# EasyEDA Pro project GIM8108-8伺泰威无刷电机.epro, board PCB1
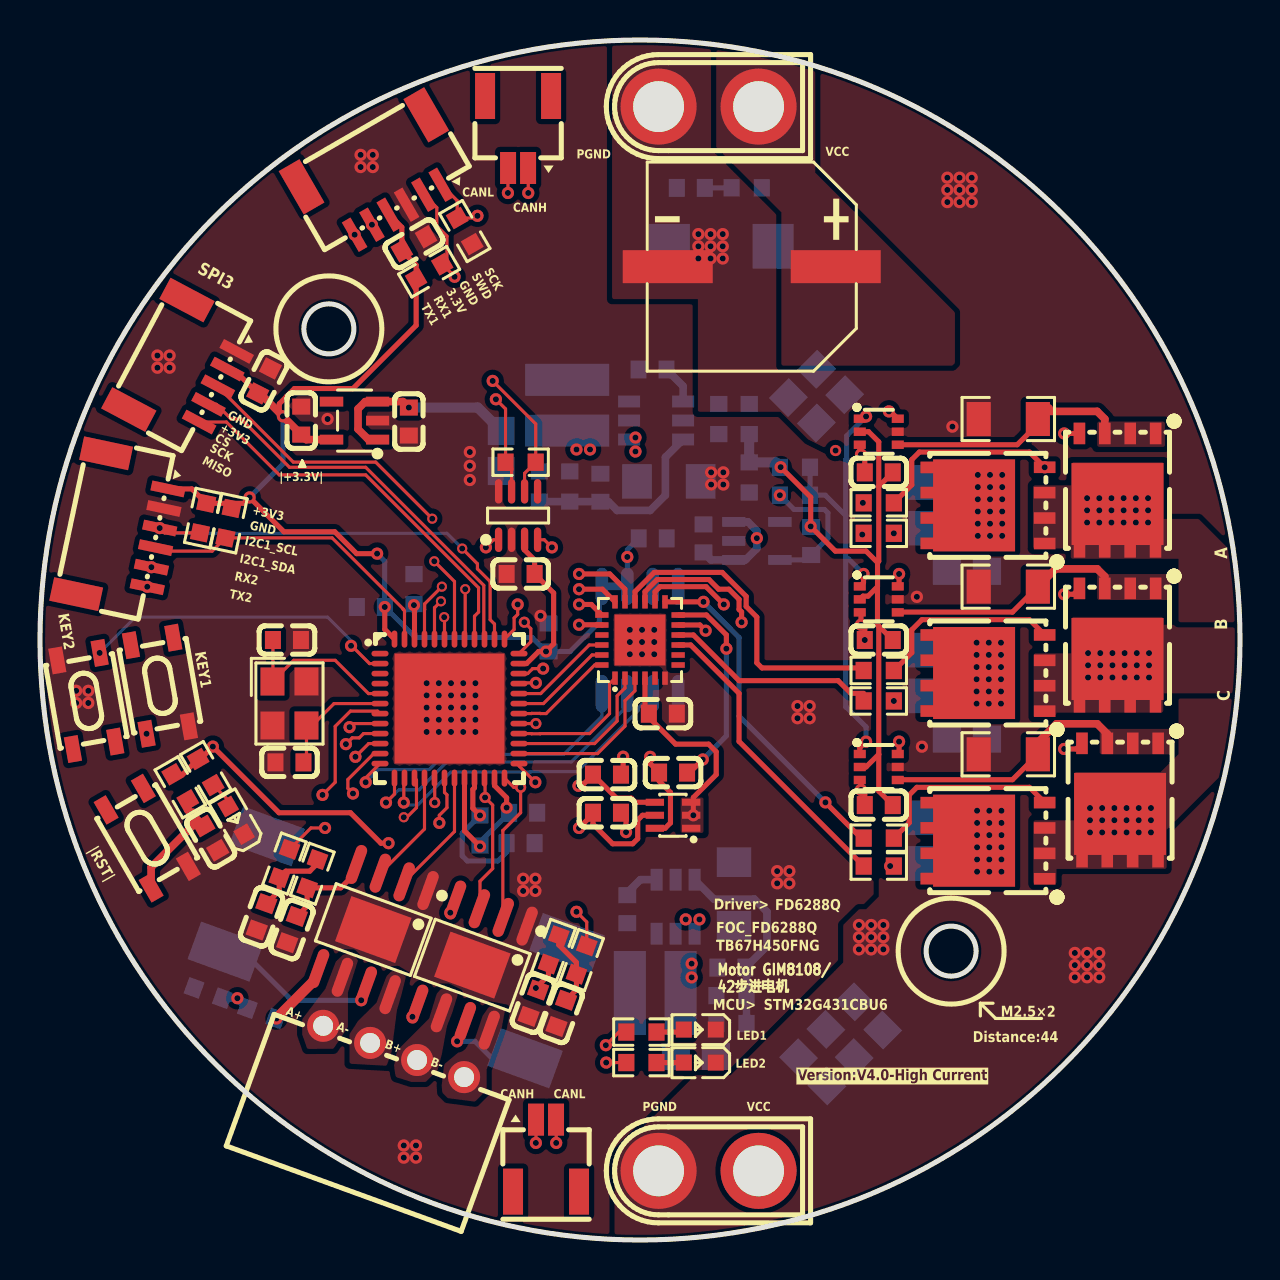
[diagram p1: board, top side]
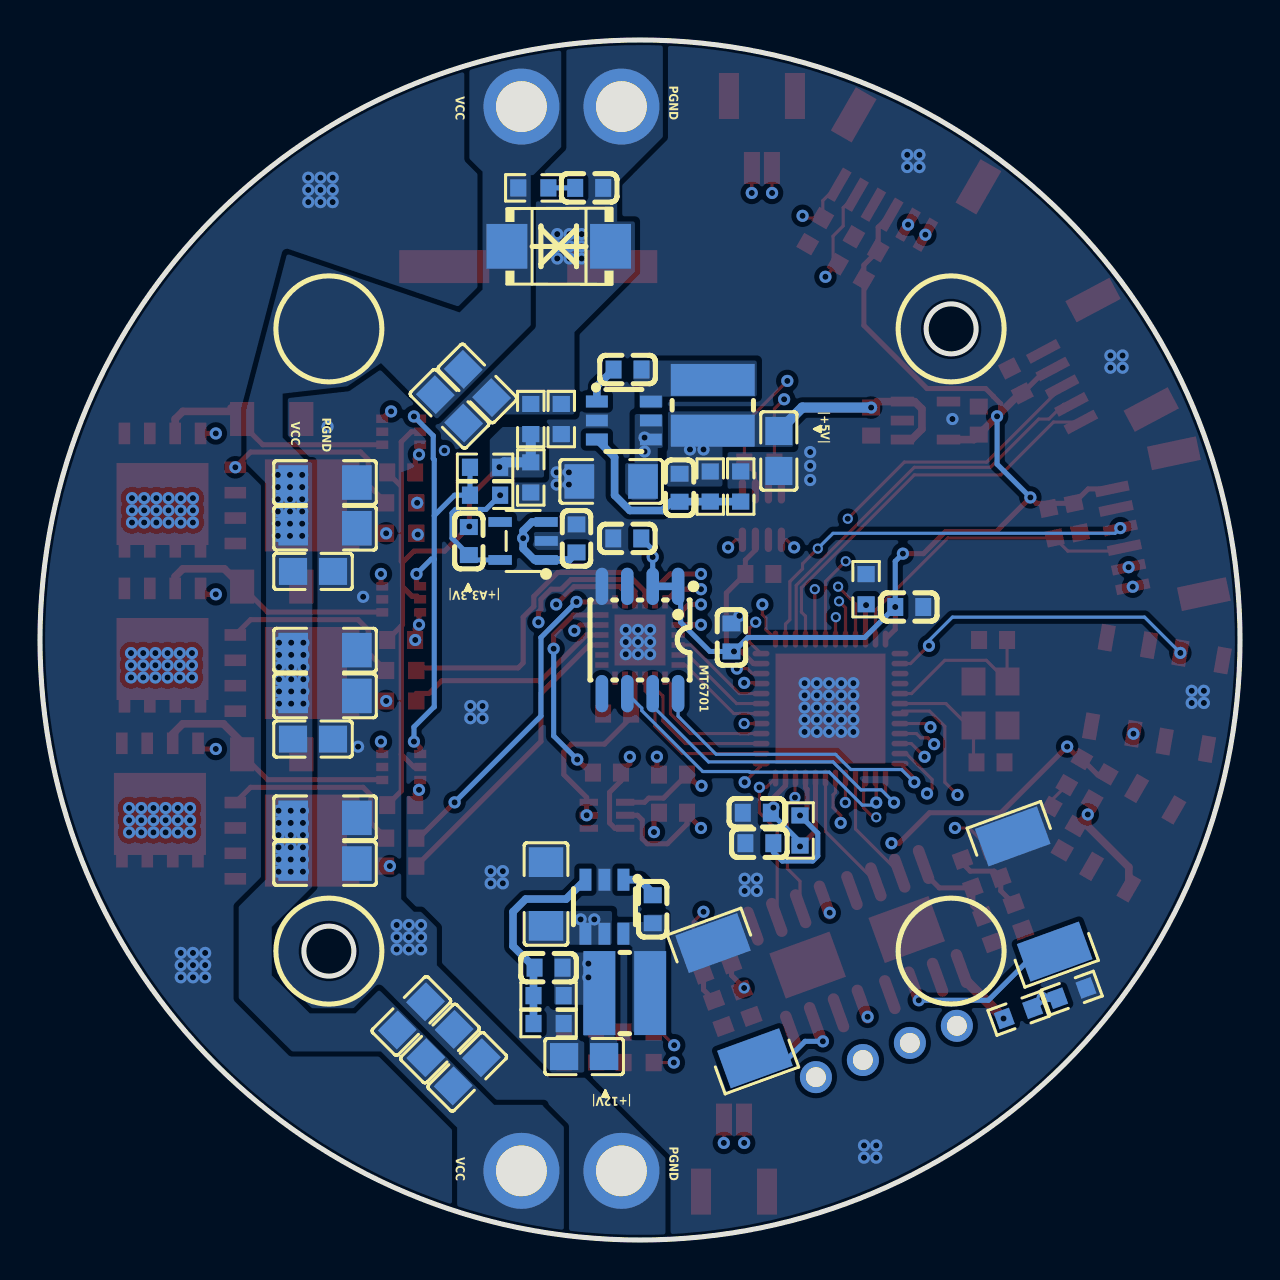
[diagram p2: board, bottom side, seen from below]

Outline 60 x 60 mm; copper layers: Top Layer, Inner1, Inner2, Bottom Layer. Coordinates in mm from the lower left corner of the outline.
Outline path: circle c14.44,45.56 r1.25 ; circle c30,30 r30 ; circle c45.56,14.44 r1.25
Stack: Top Layer 0.035mm 外层铜厚1oz / Dielectric1 0.2104mm 7628 RC49% 8.6mil / Inner1 0.0152mm 内层铜厚 / Dielectric2 1.065mm 1.1mm H/HOZ Copper / Inner2 0.0152mm 内层铜厚 / Dielectric3 0.2104mm 7628 RC49% 8.6mil / Bottom Layer 0.035mm 外层铜厚1oz

## Design rules (mm)
spacing copperThickness1oz (default): track to track 0.102, other pairs 0.152 to 0.3
spacing copperThickness2oz: track to track 0.203, other pairs 0.152 to 0.3
spacing Plane_innerPlane: track to track 0.102, other pairs 0.152 to 0.3
spacing Copper_copperRegion: track to track 0.102, other pairs 0.152 to 0.3
track width copperThickness1oz (default): min 0.127, default 0.254, max 2.54
track width copperThickness2oz: min 0.203, default 0.254, max 2.54
differential pair differentialPair (default): width min 0.127, default 0.254, max 2.54; gap min 0.152, default 0.152
net AGND uses copperRegion_copperThickness1oz
net B- uses copperRegion_copperThickness1oz
net B+ uses copperRegion_copperThickness1oz
net A- uses copperRegion_copperThickness1oz
net A+ uses copperRegion_copperThickness1oz
pour e1013 uses Copper_copperRegion, copperRegion_Copper_copperRegion
pour e1015 uses Copper_copperRegion, copperRegion_Copper_copperRegion
pour e1017 uses Copper_copperRegion, copperRegion_Copper_copperRegion
pour e1019 uses Copper_copperRegion, copperRegion_Copper_copperRegion
pour e1021 uses Copper_copperRegion, copperRegion_Copper_copperRegion
pour e1023 uses Copper_copperRegion, copperRegion_Copper_copperRegion
pour e1025 uses Copper_copperRegion, copperRegion_Copper_copperRegion
pour e1027 uses Copper_copperRegion, copperRegion_Copper_copperRegion
pour e1029 uses Copper_copperRegion, copperRegion_Copper_copperRegion
pour e1031 uses Copper_copperRegion, copperRegion_Copper_copperRegion
pour e1032 uses Copper_copperRegion, copperRegion_Copper_copperRegion
pour e1034 uses Copper_copperRegion, copperRegion_Copper_copperRegion
pour e1036 uses Copper_copperRegion, copperRegion_Copper_copperRegion
pour e1037 uses Copper_copperRegion, copperRegion_Copper_copperRegion
pour e1038 uses Copper_copperRegion, copperRegion_Copper_copperRegion
pour e1042 uses Copper_copperRegion, copperRegion_Copper_copperRegion
pour e1044 uses Copper_copperRegion, copperRegion_Copper_copperRegion
pour e1046 uses Copper_copperRegion, copperRegion_Copper_copperRegion
pour e1048 uses Copper_copperRegion, copperRegion_Copper_copperRegion
pour e1050 uses Copper_copperRegion, copperRegion_Copper_copperRegion
pour e1055 uses Copper_copperRegion, copperRegion_Copper_copperRegion
pour e1060 uses Copper_copperRegion, copperRegion_Copper_copperRegion
pour e1062 uses Copper_copperRegion, copperRegion_Copper_copperRegion
pour e1064 uses Copper_copperRegion, copperRegion_Copper_copperRegion
pour e1066 uses Copper_copperRegion, copperRegion_Copper_copperRegion
pour e1068 uses Copper_copperRegion, copperRegion_Copper_copperRegion
pour e1072 uses Copper_copperRegion, copperRegion_Copper_copperRegion
pour e1076 uses Copper_copperRegion, copperRegion_Copper_copperRegion
pour e1655 uses Copper_copperRegion, copperRegion_Copper_copperRegion
pour e1657 uses Copper_copperRegion, copperRegion_Copper_copperRegion
pour e1661 uses Copper_copperRegion, copperRegion_Copper_copperRegion
pour e1666 uses Copper_copperRegion, copperRegion_Copper_copperRegion
pour e1768 uses Copper_copperRegion, copperRegion_Copper_copperRegion

## Placement (name value [footprint] x y rotation side)
C12  47uF/50V  [C1206]  31.44 37.93 180 bottom
C13  100pF  [C0603]  28.02 37.61 90 bottom
C14  22uF/25V  [C0805]  23.06 39.45 90 bottom
C29  10uF  [C0603]  24.03 33.3 0 top
C35  100nF  [C0603]  24.16 21.36 180 bottom
C36  100nF  [C0603]  25.43 30.13 270 bottom
C37  100nF  [C0603]  16.54 31.65 0 bottom
C45  100nF  [C0603]  8.54 20.09 300 top
C54  10nF/50V  [C0603]  32.54 52.61 180 bottom
C55  22uF/50V  [C1206]  45.75 27.21 0 bottom
C56  100nF  [C0603]  11.08 16.16 250 top
C57  100nF  [C0603]  12.6 15.52 250 top
C58  100nF  [C0603]  26.06 11.33 250 top
C59  100nF  [C0603]  24.67 11.84 250 top
C61  22uF/50V  [C1206]  45.75 18.82 0 bottom
C65  100nF  [C0603]  13.06 40.97 90 top
C68  100nF  [C0603]  30.63 35.08 0 bottom
C71  20pF  [C0603]  12.35 30 180 top
C72  20pF  [C0603]  12.47 23.88 0 top
C100  100nF  [C0603]  30.62 43.52 180 bottom
C101  100nF  [C0603]  29.37 16.54 270 bottom
C102  47uF/50V  [C1206]  34.7 17.3 270 bottom
C103  100pF  [C0603]  34.57 13.62 180 bottom
C104  22uF/25V  [C0805]  32.79 9.17 180 bottom
C105  100nF  [C0603]  18.44 40.92 270 top
C106  100nF  [C0603]  38.56 34.95 90 bottom
C107  100nF  [C0603]  33.18 35.08 90 bottom
C108  22uF/50V  [C1206]  45.75 29.49 0 bottom
C109  22uF/50V  [C1206]  45.75 37.87 0 bottom
C112  100nF  [C0603]  18.7 49.81 210 top
C120  100nF  [C0603]  41.94 38.38 180 top
C121  100nF  [C0603]  41.94 30 180 top
C122  100nF  [C0603]  41.94 21.75 180 top
C123  1uF/25V  [C0603]  28.35 23.27 180 top
C124  1uF/25V  [C0603]  28.35 21.36 180 top
C125  1uF/25V  [C0603]  31.65 23.37 180 top
C126  10uF/25V  [C0603]  31.14 26.32 180 top
C127  22uF/50V  [C1206]  45.75 35.59 0 bottom
C130  330uF  [CAP-SMD_BD10.0-L10.3-W10.3-FD-LS11.0]  35.59 48.67 180 top
C131  10uF/50V  [C0805]  38.13 42.83 45 bottom
C132  10uF/50V  [C0805]  46.35 33.43 0 bottom
C133  10uF/50V  [C0805]  46.35 25.05 0 bottom
C134  10uF/50V  [C0805]  41.43 11.2 315 bottom
C136  10uF/50V  [C0805]  40 9.82 315 bottom
C138  10uF/50V  [C0805]  39.53 41.56 45 bottom
C139  10uF/50V  [C0805]  38.64 8.41 315 bottom
C141  100nF  [C0603]  11.2 42.95 63 top
C142  22uF/50V  [C1206]  45.75 21.11 0 bottom
C143  100nF  [C0603]  24.03 19.84 180 bottom
CN4  WAFER-XH2.54-4PWZ  [CONN-TH_4P-P2.50_WAFER-XH2.54-4PWZ]  17.68 9.43 340 top
CN6  XT30U-M  [CONN-TH_XT30U-M]  33.43 56.67 180 top
CN7  XT30U-M  [CONN-TH_XT30U-M]  33.43 3.46 180 top
D3  BAS16TW  [SOT-363_L2.1-W1.3-P0.65-LS2.3-BL]  31.65 21.24 90 top
D4  SMBJ36CA  [SMB_L4.4-W3.6-LS5.3-BI]  34.06 49.69 180 bottom
L1  3.3uH  [IND-SMD_L3.8-W3.8_GCRH3D16-XX]  30.76 12.35 0 bottom
L2  3.3uH  [IND-SMD_L3.8-W3.8_GCRH3D16-XX]  26.36 41.74 270 bottom
LED6  KT-0603R  [LED0603-RD]  9.81 20.98 120 top
LED7  KT-0603R  [LED0603-RD]  32.99 10.52 180 top
LED8  KT-0603R  [LED0603-RD]  32.99 8.87 180 top
Q7  NCEP4090GU  [PDFN-8_L5.8-W5.1-P1.27-LS6.1-BL]  47.4 36.73 90 top
Q8  NCEP4090GU  [PDFN-8_L5.8-W5.1-P1.27-LS6.1-BL]  53.88 37.49 180 top
Q9  NCEP4090GU  [PDFN-8_L5.8-W5.1-P1.27-LS6.1-BL]  47.4 28.35 90 top
Q10  NCEP4090GU  [PDFN-8_L5.8-W5.1-P1.27-LS6.1-BL]  53.88 29.75 180 top
Q11  NCEP4090GU  [PDFN-8_L5.8-W5.1-P1.27-LS6.1-BL]  47.4 19.97 90 top
Q12  NCEP4090GU  [PDFN-8_L5.8-W5.1-P1.27-LS6.1-BL]  54 22 180 top
R24  120  [R0603]  24.03 38.89 0 top
R28  0  [R0603]  22 20.47 270 bottom
R29  10K  [R0603]  18.7 32.54 90 bottom
R30  1K  [R0603]  7.01 22.63 300 top
R33  3.3  [R0603]  35.33 52.61 0 bottom
R47  1K  [R0603]  12.22 18.82 250 top
R48  1K  [R0603]  13.62 18.32 250 top
R49  1K  [R0603]  27.08 14 250 top
R50  1K  [R0603]  25.68 14.51 250 top
R66  100mΩ  [RES-SMD_L6.4-W3.2-R2512]  10.31 17.3 70 bottom
R67  100mΩ  [RES-SMD_L6.4-W3.2-R2512]  25.3 11.97 70 bottom
R72  110K  [R0603]  26.49 37.67 270 bottom
R73  15K  [R0603]  24.96 37.67 270 bottom
R74  390K  [R0603]  34.57 12.22 0 bottom
R75  20K  [R0603]  34.57 10.82 0 bottom
R79  1K  [R0603]  8.28 23.4 300 top
R80  0  [R0603]  35.46 38.13 90 bottom
R81  0  [R0603]  33.94 41.05 90 bottom
R82  0  [R0603]  35.46 41.05 90 bottom
R85  10K  [R0603]  19.46 48.42 210 top
R86  10K  [R0603]  21.24 50.45 120 top
R87  10  [R0603]  41.94 36.86 0 top
R88  10  [R0603]  41.94 28.48 0 top
R89  10  [R0603]  41.94 20.09 0 top
R90  10  [R0603]  41.94 35.33 0 top
R91  10  [R0603]  41.94 18.7 0 top
R92  10  [R0603]  41.94 26.95 0 top
R93  39K  [R0603]  11.08 11.33 340 bottom
R95  3K  [R0603]  8.41 12.35 340 bottom
R96  2mΩ  [R1206]  48.41 41.05 0 top
R97  2mΩ  [R1206]  48.41 32.67 0 top
R98  2mΩ  [R1206]  48.41 24.28 0 top
R101  10K  [R0603]  37.75 37.24 0 bottom
R102  10K  [R0603]  37.75 38.64 180 bottom
R103  1K  [R0603]  30.07 10.4 0 top
R104  1K  [R0603]  30.07 8.87 0 top
R105  4.7K  [R0603]  8.16 36.1 258 top
R106  4.7K  [R0603]  9.43 35.84 258 top
SW1  K2-1808SN-A3SW-01  [SW-SMD_4P-L4.2-W3.3-P2.15-LS5.1]  5.36 20.09 120 top
SW3  K2-1808SN-A3SW-01  [SW-SMD_4P-L4.2-W3.3-P2.15-LS5.1]  6 27.71 100 top
SW4  K2-1808SN-A3SW-01  [SW-SMD_4P-L4.2-W3.3-P2.15-LS5.1]  2.31 26.95 280 top
U1  STM32G431CBU6  [VQFN-48_L7.0-W7.0-P0.50-BL-EP5.5]  20.47 26.57 270 top
U2  INA199A1DCKR  [SC-70-6_L2.2-W1.3-P0.65-LS2.1-BR]  41.94 40.41 180 top
U4  INA199A1DCKR  [SC-70-6_L2.2-W1.3-P0.65-LS2.1-BR]  41.94 23.65 180 top
U5  MAX3051EKA+T  [SOT-23-8_L3.0-W1.7-P0.65-LS2.8-TL]  23.9 36.22 90 top
U9  TB67H450FNG,EL  [HSOP-8_L5.0-W4.0-P1.27-LS6.2-BL-EP]  16.66 15.52 160 top
U10  FD6288Q  [QFN-24_L4.0-W4.0-P0.50-BL-EP2.6]  30 30 0 top
U11  MT6701CT-STD  [SOP-8_L4.9-W3.9-P1.27-LS6.0-BL]  30 30 0 bottom
U13  SPX3819M5-L-3-3/TR  [SOT-23-5_L3.0-W1.7-P0.95-LS2.8-BL]  15.73 40.97 90 top
U20  INA199A1DCKR  [SC-70-6_L2.2-W1.3-P0.65-LS2.1-BR]  41.94 32.03 180 top
U23  ME3121AM6G  [SOT-23-6_L2.9-W1.6-P0.95-LS2.8-BR]  30.81 40.97 0 bottom
U24  ME3121AM6G  [SOT-23-6_L2.9-W1.6-P0.95-LS2.8-BR]  31.78 16.67 90 bottom
U25  SPX3819M5-L-3-3/TR  [SOT-23-5_L3.0-W1.7-P0.95-LS2.8-BL]  35.84 34.95 90 bottom
U27  ZX-SH1.0-2PWT  [CONN-SMD_2P-P1.00_HX-1.0-2P-WT]  23.9 55.4 180 top
U28  ZX-SH1.0-2PWT  [CONN-SMD_2P-P1.00_HX-1.0-2P-WT]  25.3 4.22 0 top
U29  ZX-SH1.0-6PWT  [CONN-SMD_6P-P1.00_MEGASTAR_ZX-SH1.0-6PWT]  17.05 52.99 210 top
U30  ZX-SH1.0-5PWT  [CONN-SMD_5P-P1.00_MEGASTAR_ZX-SH1.0-5PWT]  7.39 43.46 242 top
U31  TB67H450FNG,EL  [HSOP-8_L5.0-W4.0-P1.27-LS6.2-BL-EP]  21.62 13.74 160 top
U32  ZX-SH1.0-6PWT  [CONN-SMD_6P-P1.00_MEGASTAR_ZX-SH1.0-6PWT]  4.22 35.46 258 top
X3  8MHz  [CRYSTAL-SMD_4P-L3.2-W2.5-BL]  12.47 26.83 270 top

## Footprints (pads in the part's own frame, mm; a bottom-side part is the same pattern mirrored in y, then rotated)
C0603
  rect 0.8x0.9 smd: 1(-0.7,0) 2(0.7,0)
C0805
  rect 1.41x1.35 smd: 1(-1,0) 2(1,0)
C1206
  rect 1.485x1.728 smd: 1(-1.593,0) 2(1.593,0)
CAP-SMD_BD10.0-L10.3-W10.3-FD-LS11.0
  rect 4.5x1.65 smd: 1(-4.2,0) 2(4.2,0)
CONN-SMD_2P-P1.00_HX-1.0-2P-WT
  rect 0.8x1.6 smd: 1(-0.5,1.8) 2(0.5,1.8)
  rect 1x2.3 smd: 3(1.65,-1.8) 4(-1.65,-1.8)
CONN-SMD_5P-P1.00_MEGASTAR_ZX-SH1.0-5PWT
  rect 0.5x1.7 smd: 1(-2,1.7) 2(-1,1.7) 3(0,1.7) 4(1,1.7) 5(2,1.7)
  rect 1.2x2.5 smd: 6(3.1,-1.7) 7(-3.1,-1.7)
CONN-SMD_6P-P1.00_MEGASTAR_ZX-SH1.0-6PWT
  rect 0.5x1.7 smd: 1(-2.5,1.7) 2(-1.5,1.7) 3(-0.5,1.7) 4(0.5,1.7) 5(1.5,1.7) 6(2.5,1.7)
  rect 1.2x2.5 smd: 7(3.6,-1.7) 8(-3.6,-1.7)
CONN-TH_4P-P2.50_WAFER-XH2.54-4PWZ
  round 1.6 hole 1: 1(-3.75,0) 2(-1.25,0) 3(1.25,0) 4(3.75,0)
CONN-TH_XT30U-M
  round 3.8 hole 2.54: 1(-2.5,0) 2(2.5,0)
CRYSTAL-SMD_4P-L3.2-W2.5-BL
  rect 1.4x1.2 smd: 1(-1.1,-0.85) 2(1.1,-0.85) 3(1.1,0.85) 4(-1.1,0.85)
HSOP-8_L5.0-W4.0-P1.27-LS6.2-BL-EP
  oval 0.574x2.038 smd: 1(-1.905,-2.769) 2(-0.635,-2.769) 3(0.635,-2.769) 4(1.905,-2.769) 5(1.905,2.769) 6(0.635,2.769) 7(-0.635,2.769) 8(-1.905,2.769)
  rect 3.2x2.4 smd: 9(0,0)
IND-SMD_L3.8-W3.8_GCRH3D16-XX
  rect 1.6x4.2 smd: 1(-1.27,0) 2(1.27,0)
LED0603-RD
  rect 0.8x0.8 smd: 1(-0.799,0) 2(0.799,0)
PDFN-8_L5.8-W5.1-P1.27-LS6.1-BL
  rect 0.58x1.079 smd: 1(-1.905,-2.834) 2(-0.635,-2.834) 3(0.635,-2.834) 4(1.905,-2.834)
  rect 0.58x1.08 smd: 5(1.9,2.834) 6(0.64,2.834) 7(-0.63,2.834) 8(-1.9,2.834)
  rect 4.6x4.1 smd: 9(0,0.695)
QFN-24_L4.0-W4.0-P0.50-BL-EP2.6
  rect 0.28x0.665 smd: 1(-1.25,-1.907) 2(-0.75,-1.907) 3(-0.25,-1.907) 4(0.25,-1.907) 5(0.75,-1.907) 6(1.25,-1.907) 13(1.25,1.907) 14(0.75,1.907) 15(0.25,1.907) 16(-0.25,1.907) 17(-0.75,1.907) 18(-1.25,1.907)
  rect 0.665x0.28 smd: 7(1.907,-1.25) 8(1.907,-0.75) 9(1.907,-0.25) 10(1.907,0.25) 11(1.907,0.75) 12(1.907,1.25) 19(-1.907,1.25) 20(-1.907,0.75) 21(-1.907,0.25) 22(-1.907,-0.25) 23(-1.907,-0.75) 24(-1.907,-1.25)
  rect 2.55x2.55 smd: 25(0,0)
R0603
  rect 0.806x0.864 smd: 1(-0.753,0) 2(0.753,0)
R1206
  rect 1.208x1.701 smd: 1(-1.479,0) 2(1.479,0)
RES-SMD_L6.4-W3.2-R2512
  rect 2x3.3 smd: 1(-3.067,0) 2(3.067,0)
SC-70-6_L2.2-W1.3-P0.65-LS2.1-BR
  rect 0.6x0.42 smd: 1(0.95,-0.65) 2(0.95,0) 3(0.95,0.65) 4(-0.95,0.65) 5(-0.95,0) 6(-0.95,-0.65)
SMB_L4.4-W3.6-LS5.3-BI
  rect 2.047x2.241 smd: 1(-2.591,0) 2(2.591,0)
SOP-8_L4.9-W3.9-P1.27-LS6.0-BL
  oval 0.63x1.865 smd: 1(-1.905,-2.683) 2(-0.635,-2.683) 3(0.635,-2.683) 4(1.905,-2.683) 5(1.905,2.683) 6(0.635,2.683) 7(-0.635,2.683) 8(-1.905,2.683)
SOT-23-5_L3.0-W1.7-P0.95-LS2.8-BL
  rect 0.49x1.157 smd: 1(-0.95,-1.153) 2(0,-1.153) 3(0.95,-1.153)
  rect 0.49x1.175 smd: 4(0.95,1.153) 5(-0.95,1.153)
SOT-23-6_L2.9-W1.6-P0.95-LS2.8-BR
  rect 1.1x0.6 smd: 1(1.35,-0.95) 2(1.35,0) 3(1.35,0.95) 4(-1.35,0.95) 5(-1.35,0) 6(-1.35,-0.95)
SOT-23-8_L3.0-W1.7-P0.65-LS2.8-TL
  oval 1.222x0.364 smd: 1(-1.211,0.975) 2(-1.211,0.325) 3(-1.211,-0.325) 4(-1.211,-0.975) 5(1.211,-0.975) 6(1.211,-0.325) 7(1.211,0.325) 8(1.211,0.975)
SOT-363_L2.1-W1.3-P0.65-LS2.3-BL
  rect 0.35x0.916 smd: 1(-0.65,-0.908) 2(0,-0.908) 3(0.65,-0.908) 4(0.65,0.908) 5(0,0.908) 6(-0.65,0.908)
SW-SMD_4P-L4.2-W3.3-P2.15-LS5.1
  rect 1.3x0.7 smd: 1(-2.25,1.075) 2(2.25,1.075) 3(-2.25,-1.075) 4(2.25,-1.075)
VQFN-48_L7.0-W7.0-P0.50-BL-EP5.5
  oval 0.28x0.85 smd: 1(-2.75,-3.474) 2(-2.25,-3.474) 3(-1.75,-3.474) 4(-1.25,-3.474) 5(-0.75,-3.474) 6(-0.25,-3.474) 7(0.25,-3.474) 8(0.75,-3.474) 9(1.25,-3.474) 10(1.75,-3.474) 11(2.25,-3.474) 12(2.75,-3.474) 25(2.75,3.474) 26(2.25,3.474) 27(1.75,3.474) 28(1.25,3.474) 29(0.75,3.474) 30(0.25,3.474) 31(-0.25,3.474) 32(-0.75,3.474) 33(-1.25,3.474) 34(-1.75,3.474) 35(-2.25,3.474) 36(-2.75,3.474)
  oval 0.85x0.28 smd: 13(3.474,-2.75) 14(3.474,-2.25) 15(3.474,-1.75) 16(3.474,-1.25) 17(3.474,-0.75) 18(3.474,-0.25) 19(3.474,0.25) 20(3.474,0.75) 21(3.474,1.25) 22(3.474,1.75) 23(3.474,2.25) 24(3.474,2.75) 37(-3.474,2.75) 38(-3.474,2.25) 39(-3.474,1.75) 40(-3.474,1.25) 41(-3.474,0.75) 42(-3.474,0.25) 43(-3.474,-0.25) 44(-3.474,-0.75) 45(-3.474,-1.25) 46(-3.474,-1.75) 47(-3.474,-2.25) 48(-3.474,-2.75)
  rect 5.5x5.5 smd: 49(0,0)

## Nets
As in the schematic.

Pads without a net: SW1 2 4; SW3 2 4; SW4 2 4; U1 1 3 4; U5 5; U10 5 7 8 21; U11 3 5; U13 4; U25 4; U27 3 4; U28 3 4; U29 7 8; U30 6 7; U32 7 8

## Via types
v1: diameter 0.61, hole 0.305, Top Layer to Bottom Layer, 321 vias
v2: diameter 0.559, hole 0.305, Top Layer to Bottom Layer, 7 vias
v3: diameter 0.508, hole 0.305, Top Layer to Bottom Layer, 8 vias

## Routing (per net, layer and track width the routed paths; a pad name or vN(x,y) marks a point on that pad's centre or on a via; arc(x,y) is an arc through that point)
+3.3V: length 143.8
  Top Layer w0.254: U5.3 24.23,34.5 24.73,34 C29.2 25.68,32.35 25.68,29.81 v1(25.3,29.43) 24.93,29.43 24.33,28.82 U1.35 ; U1.48 17.24,30.53 v1(17.24,31.65) ; U20.3 41.05,31.32 v1(41.05,30.76) 41.24,30.57 v1(41.24,30) ; 11.97,41.36 11.97,41.81 12.33,42.18 12.33,42.19 12.72,42.57 15.65,42.57 18.81,45.73 R85.2 18.81,48.75 18.09,49.46 18.09,50.64 17.46,51.26 ; U1.23 22.72,22.72 23.33,22.11 v1(23.33,21.62) ; U30.2 9.54,43.55 9.62,43.47 9.75,43.47 C141.1 ; U4.3 41.05,22.94 v1(41.05,22.51) 41.24,22.32 C122.2 ; v1(17.43,19.84) 17.05,19.84 15.52,21.36 11.95,21.36 v1(8.64,24.67) 8.02,24.05 R79.1 7.14,23.29 R30.1 ; v1(22,19.68) 21.22,20.45 U1.20 ; C120.2 41.24,39.08 v1(41.05,39.27) 40.99,39.33 U2.3 ; v1(16.85,34.32) 15.83,34.32 14.74,35.41 12.19,35.41 v1(10.48,37.13) 10.19,36.83 8.31,36.83 7.59,37.55 U32.1
  Top Layer w0.381: C141.1 11,42.33 11.97,41.36 v1(12.15,41.18) C65.1 13.31,40.02 U13.5
  Inner1 w0.254: v1(8.64,24.67) 8.64,29.72 10.57,31.65 v1(17.24,31.65)
  Inner2 w0.254: v1(41.05,30.76) 40.63,31.18 ; 40.63,31.18 40.41,31.4 ; 40.63,31.18 40.29,30.84 40.29,23.27 v1(41.05,22.51) ; 40.41,31.4 36.99,31.4 34.23,34.15 v1(29.37,34.15) ; 40.41,31.4 40.41,38.64 v1(41.05,39.27) ; v1(22,19.68) 21.84,19.84 v1(17.43,19.84)
  Bottom Layer w0.254: C35.2 22,19.91 R28.2 ; v1(16.85,34.32) 17.24,33.94 v1(17.24,31.65) 18.76,30.13 24.6,30.13 v1(25.3,29.43) ; v1(12.15,41.18) 12.15,38.79 v1(10.48,37.13) ; C68.1 29.37,34.51 v1(29.37,34.15) U11.2 ; 25.43,29.43 26.51,29.43 27.97,30.89 27.97,32.56 U11.1
  Bottom Layer w0.381: U11.2 U11.1
+5V: length 25.6
  Top Layer w0.381: U13.1 16.42,40.02 15.9,40.54 15.9,41.56 16.27,41.92 U13.3 18.15,41.92 v1(18.44,41.62)
  Inner1 w0.508: v1(27.5,39.53) 31.95,35.08 35.83,35.08 v1(35.84,35.09)
  Bottom Layer w0.381: U25.3 35.4,35.9 35.84,35.46 v1(35.84,35.09) 35.84,34.57 35.27,34 U25.1 33.55,34 C107.1
  Bottom Layer w0.508: v1(18.44,41.62) 21.89,41.62 C14.2
  vias: v1(26.82,39.53)
+12V: length 18.6
  Top Layer w0.254: U10.4 30.25,26.51 C126.2 30.44,26.13 31.78,24.79 33.43,24.79 33.81,24.41 33.81,23.27 32.67,22.13 v1(32.67,21.24)
  Inner1 w0.254: v1(32.58,13.82) 32.09,13.82 31.27,14.63 31.27,16.28 32.67,17.68 v1(32.67,21.24)
  vias: v1(32.58,13.13)
+AVDD_3.3V: length 6.9
  Bottom Layer w0.254: U25.5 38.31,34 C106.1 39.4,35.09 39.4,36.35 39.22,36.53 37.7,36.53 v1(36.99,37.24)
AGND: length 34.8
  Top Layer w0.254: 41.94,37.68 C120.1 ; 41.94,37.68 41.94,39.91 41.43,40.41 U2.2 ; 41.94,37.68 41.94,33.94 41.87,33.87 41.3,34.44 39.77,34.44 v1(38.53,35.68) 38.53,37.14 v1(37.03,38.64) ; 41.94,30.7 41.94,24.28 ; 41.94,30.7 C121.1 ; 41.94,30.7 41.87,30.76 41.87,32.66 41.4,32.19 41.15,32.19 U20.2 ; 41.94,24.28 41.3,23.65 U4.2 ; 41.94,24.28 41.94,22.44 C122.1 ; 41.88,33.87 41.88,32.67
  Bottom Layer w0.508: R82.1 R80.2 36.79,38.88 v1(37.03,38.64)
GND:
  vias: v1(1.81,27.46) v1(1.81,26.85) v1(2.42,27.46) v1(2.42,26.85) v1(5.87,44.22) v1(5.87,43.61) v1(6.48,44.22) v1(6.48,43.61) v1(14.38,41.05) v1(16.03,54.26) v1(16.03,53.65) v1(16.64,54.26) v1(16.64,53.65) v1(18.19,4.73) v1(18.19,4.12) v1(18.8,4.73) v1(18.8,4.12) v1(19.33,27.84) v1(19.33,27.23) v1(19.33,26.62) v1(19.33,26.01) v1(19.33,25.4) v1(19.94,27.84) v1(19.94,27.23) v1(19.94,26.62) v1(19.94,26.01) v1(19.94,25.4) v1(20.55,27.84) v1(20.55,27.23) v1(20.55,26.62) v1(20.55,26.01) v1(20.55,25.4) v1(21.16,27.84) v1(21.16,27.23) v1(21.16,26.62) v1(21.16,26.01) v1(21.16,25.4) v1(21.49,39.4) v1(21.49,38.71) v1(21.49,38) v1(21.77,27.84) v1(21.77,27.23) v1(21.77,26.62) v1(21.77,26.01) v1(21.77,25.4) v1(24.16,18.06) v1(24.16,17.45) v1(24.77,18.06) v1(24.77,17.45) v1(25.03,31.21) v1(29.49,30.51) v1(29.49,29.9) v1(29.49,29.29) v1(30.1,30.51) v1(30.1,29.9) v1(30.1,29.29) v1(30.71,30.51) v1(30.71,29.9) v1(30.71,29.29) v1(33.56,38.38) v1(33.56,37.77) v1(34.17,38.38) v1(34.17,37.77) v1(36.86,18.44) v1(36.86,17.83) v1(37.47,18.44) v1(37.47,17.83) v1(37.87,26.7) v1(37.87,26.09) v1(38.48,26.7) v1(38.48,26.09)
PGND:
  vias: v1(32.92,50.29) v1(32.92,49.69) v1(32.92,49.08) v1(33.53,50.29) v1(33.53,49.69) v1(33.53,49.08) v1(34.14,50.29) v1(34.14,49.69) v1(34.14,49.08) v1(40.95,15.75) v1(40.95,15.14) v1(40.95,14.53) v1(41.56,15.75) v1(41.56,15.14) v1(41.56,14.53) v1(42.17,15.75) v1(42.17,15.14) v1(42.17,14.53) v1(43.84,32.16) v1(44.1,24.67) v1(45.37,53.11) v1(45.37,52.5) v1(45.37,51.89) v1(45.62,40.67) v1(45.98,53.11) v1(45.98,52.5) v1(45.98,51.89) v1(46.59,53.11) v1(46.59,52.5) v1(46.59,51.89) v1(51.74,14.35) v1(51.74,13.74) v1(51.74,13.13) v1(52.35,14.35) v1(52.35,13.74) v1(52.35,13.13) v1(52.96,14.35) v1(52.96,13.74) v1(52.96,13.13)
VCC: length 39.3
  Top Layer w0.508: v1(11.82,11.07) 11.82,11.09 13.67,12.94
  Inner1 w0.508: CN7.1 31.74,7.65 24.03,7.65 22.76,6.38 15.4,6.38 11.82,9.95 v1(11.82,11.07) 12.97,12.22 14.63,12.22 15.65,11.2 18.58,11.2 v1(18.62,11.16)
  vias: v1(29.77,40.12) v1(29.77,39.42) v1(32.29,16.03) v1(32.97,16.03) v1(46.83,29.87) v1(46.83,29.26) v1(46.83,28.65) v1(46.83,28.04) v1(46.83,27.43) v1(46.83,26.82) v1(46.89,38.25) v1(46.89,37.65) v1(46.89,37.04) v1(46.89,36.43) v1(46.89,35.82) v1(46.89,35.21) v1(46.85,21.46) v1(46.85,20.85) v1(46.85,20.24) v1(46.85,19.64) v1(46.85,19.03) v1(46.85,18.42) v1(47.44,29.87) v1(47.44,29.26) v1(47.44,28.65) v1(47.44,28.04) v1(47.44,27.43) v1(47.44,26.82) v1(47.5,38.25) v1(47.5,37.65) v1(47.5,37.04) v1(47.5,36.43) v1(47.5,35.82) v1(47.5,35.21) v1(47.46,21.46) v1(47.46,20.85) v1(47.46,20.24) v1(47.46,19.64) v1(47.46,19.03) v1(47.46,18.42) v1(48.05,29.87) v1(48.05,29.26) v1(48.05,28.65) v1(48.05,28.04) v1(48.05,27.43) v1(48.05,26.82) v1(48.11,38.25) v1(48.11,37.65) v1(48.11,37.04) v1(48.11,36.43) v1(48.11,35.82) v1(48.11,35.21) v1(48.07,21.46) v1(48.07,20.85) v1(48.07,20.24) v1(48.07,19.64) v1(48.07,19.03) v1(48.07,18.42)
VDDA: length 7.4
  Top Layer w0.254: U1.21 21.72,22.61 21.64,22.53 21.64,21.58 v1(22,21.23)
  Bottom Layer w0.254: C143.2 23.33,19.39 22.89,18.95 21.36,18.95 21.11,19.2 21.11,20.34 v1(22,21.23)
ADC_IN1: length 45.2
  Top Layer w0.158: U1.8 15.66,25.82 v1(15.48,25.64)
  Top Layer w0.254: U2.6 42.52,41.43 v1(42.45,41.43)
  Inner2 w0.158: v1(42.45,41.43) 39.4,44.48 23.14,44.48 15.01,36.35 15.01,28.86 15.48,28.39 v1(15.48,25.64)
ADC_IN2: length 56.7
  Top Layer w0.158: v1(15.3,24.79) 15.61,25.11 15.96,25.11 16.18,25.32 U1.9
  Top Layer w0.254: v1(42.95,33.3) 42.95,32.75 U20.6
  Inner2 w0.158: v1(15.3,24.79) 14.76,25.33 14.76,25.68 15.14,26.06 15.14,28.22 14.75,28.61 14.75,36.47 23.14,44.86 39.91,44.86 43.46,41.3 43.46,33.81 v1(42.95,33.3)
ADC_IN3: length 66.9
  Top Layer w0.158: v1(15.77,24.16) 16.43,24.82 U1.10
  Top Layer w0.254: v1(42.95,24.92) 42.95,24.37 U4.6
  Inner2 w0.158: v1(15.77,24.16) 15.67,24.26 15.07,24.26 14.5,24.84 14.5,36.58 23.16,45.24 40.03,45.24 43.84,41.43 43.84,33.13 43.21,32.5 43.21,27.57 43.23,27.56 43.23,25.19 v1(42.95,24.92)
ADC_IN4: length 17
  Top Layer w0.158: v1(15.65,22.32) 15.4,22.58 15.4,23.03 16.69,24.32 U1.11
  Inner2 w0.158: v1(9.87,12.09) 15.65,17.87 v1(15.65,22.32)
  Bottom Layer w0.381: R93.1 v1(9.87,12.09) R95.2
AIN1: length 5.7
  Top Layer w0.158: U1.16 19.22,20.55 U9.3
AIN2: length 6.2
  Top Layer w0.158: 18.21,17.91 20.72,20.42 U1.19
BIN1: length 7.7
  Top Layer w0.158: 21.71,15.93 22,16.22 22,17.94 22.63,18.57 22.63,21.75 v2(22.25,22.13) 22.25,23.07 U1.22
BIN2: length 8.6
  Top Layer w0.158: U1.24 23.69,22.63 v2(24.03,22.63) 24.03,21.36 23.14,20.47 23.14,15.74 22.9,15.5
BOOT0: length 1.7
  Top Layer w0.254: v1(18.7,31.75) 18.72,31.72 U1.46
CANH: length 57.2
  Top Layer w0.158: v1(24.79,4.85) 24.8,4.86 U28.1 ; U5.7 23.58,38.59 R24.1 23.28,41.55 v1(22.79,42.04) ; U27.1 24.41,53.59 v1(24.41,52.35)
  Inner1 w0.158: v1(22.79,42.04) 23.27,42.51 23.27,46.51 23.65,46.89 23.65,51.59 v1(24.41,52.35)
  Inner2 w0.158: v1(24.79,4.85) 22.79,6.85 22.79,30.56 21.76,31.6 21.76,35.73 22.51,36.48 22.51,41.75 v1(22.79,42.04)
CANL: length 58.6
  Top Layer w0.158: v1(23.4,52.35) 23.4,53.59 U27.2 ; v1(25.81,4.85) 25.81,6.01 U28.2 ; U5.6 24.23,38.33 R24.2 24.78,40.8 v1(22.63,42.95)
  Inner1 w0.158: v1(23.4,52.35) 23.27,52.22 23.27,47.27 22.63,46.64 v1(22.63,42.95)
  Inner2 w0.158: v1(22.63,42.95) 25.81,39.78 25.81,35.17 26.32,34.66 26.32,28.37 25.81,27.86 v1(25.81,4.85)
FDCAN1_RX: length 9.6
  Top Layer w0.158: U5.4 25.21,35.01 v1(25.59,34.63) ; v1(24.79,27.86) 23.99,27.86 U1.33
  Inner2 w0.158: v1(24.79,27.86) 25.44,27.86 26.06,28.48 26.06,34.16 v1(25.59,34.63)
FDCAN1_TX: length 9.3
  Top Layer w0.158: U1.34 24.38,28.32 24.63,28.57 v1(25.16,28.57) ; v1(22.29,34.63) 22.68,35.01 U5.1
  Inner2 w0.158: v1(22.29,34.63) 23.27,33.66 23.27,30.7 25.16,28.81 v1(25.16,28.57)
GH_A: length 18
  Top Layer w0.254: v1(26.95,31.78) 27.56,31.78 U10.19
  Inner1 w0.254: 41.05,36.86 40.54,36.86 40.16,36.48 40.16,35.72 38.36,33.91 31.62,33.91 29.87,32.16 27.46,32.16 27.08,31.78 v1(26.95,31.78)
  vias: v1(41.14,36.86)
GH_B: length 16
  Top Layer w0.254: U10.16 29.75,32.42 30.71,33.38 34.11,33.38 35.31,32.18 35.31,31.68 35.84,31.14 35.84,28.86 36.1,28.6 41.06,28.6 41.18,28.73
GH_C: length 17.1
  Top Layer w0.254: U10.13 v1(33.18,31.91) ; R89.1 41.06,20.09 v1(39.27,21.88)
  Bottom Layer w0.254: v1(39.27,21.88) 34.95,26.2 34.95,30.13 v1(33.18,31.91)
GL_A: length 11.3
  Top Layer w0.254: U10.11 33,30.75 v1(33.28,30.47)
  Inner1 w0.254: v1(33.28,30.47) 33.77,30.47 35.08,31.78 37.62,31.78 v1(41.11,35.27)
GL_B: length 10.5
  Top Layer w0.254: U10.10 32.67,30.25 34.95,27.97 39.91,27.97 40.54,27.33 41.18,27.33
GL_C: length 15.3
  Top Layer w0.254: U10.9 32.54,29.75 34.95,27.33 34.95,24.93 R91.1
I2C1_SCL: length 22.9
  Top Layer w0.158: 8,35.36 6.22,35.36 v1(5.99,35.6) ; U1.38 22.72,30.8 22.51,31.02 22.51,32.92 21.87,33.56 21.87,33.81 v3(21.11,34.57)
  Bottom Layer w0.158: v1(5.99,35.6) 6.25,35.33 20.35,35.33 v3(21.11,34.57)
I2C1_SDA: length 15.7
  Top Layer w0.158: U1.47 18.22,31.46 18.16,31.52 18.16,31.55 14.61,35.11 R106.2 8.61,34.44 5.95,34.44 U32.4
KEY1: length 18.7
  Top Layer w0.158: v3(18.19,21.14) 18.34,21.14 18.82,21.62 18.82,23 U1.15
  Inner1 w0.158: v3(18.19,21.14) 12.88,21.14 12.49,20.74 7.39,20.74 5.33,22.8 v1(5.33,25.31)
KEY2: length 15.9
  Top Layer w0.158: U1.2 16.47,28.82 15.59,29.71 v1(15.55,29.71)
  Bottom Layer w0.158: v1(15.55,29.71) 15.55,29.97 14.38,31.14 4.77,31.14 v1(2.98,29.35)
LED1: length 19.9
  Top Layer w0.158: U1.29 v2(24.79,25.82) ; R103.1 28.95,10.4 v1(28.29,9.74)
  Inner1 w0.158: v1(28.29,9.74) 27.4,10.63 27.4,15.32 27.72,15.64 27.72,16.91 25.3,19.33 25.3,25.31 v2(24.79,25.82)
LED2: length 18
  Top Layer w0.158: v1(24.77,22.89) 23.96,23.69 23.96,23.82 U1.25 ; v1(28.31,8.87) R104.1
  Inner1 w0.158: v1(24.77,22.89) 24.77,19.36 27.46,16.67 27.46,15.75 27.14,15.43 27.14,10.04 v1(28.31,8.87)
NRST: length 19.3
  Top Layer w0.158: U1.7 16.88,26.44 15.52,26.44 14.76,25.68 14.76,22.89 v1(14.12,22.25)
  Top Layer w0.381: SW1.1 5.56,18.64 7.61,20.69 v1(7.61,21.28) ; v1(7.61,21.28) 7.39,21.5 R30.2 ; v1(7.61,21.28) C45.1
  Inner1 w0.158: v1(7.61,21.28) 12.51,21.28 13.49,22.25 v1(14.12,22.25)
OSC_IN: length 8.6
  Top Layer w0.158: C71.2 11.65,27.95 ; 11.65,27.95 12.68,28.98 14.76,28.98 16.42,27.32 U1.5 ; 11.65,27.95 X3.1
OSC_OUT: length 6.2
  Top Layer w0.158: 13.32,25.44 14.7,26.82 U1.6 ; 13.32,25.44 13.32,24.03 C72.2 ; 13.32,25.44 13.32,25.72
PWMA: length 9.6
  Top Layer w0.158: R47.1 13.55,20.6 v1(14.25,20.6) ; v2(19.74,21.87) 19.74,23.09 U1.17
  Inner1 w0.158: v1(14.25,20.6) 14.38,20.47 18.34,20.47 v2(19.74,21.87)
PWMAH: length 5.1
  Top Layer w0.158: U1.32 25.03,27.32 27.46,29.75 U10.22
PWMAL: length 6.8
  Top Layer w0.158: U10.1 28.48,27.82 28.48,26.32 27.48,25.32 25.01,25.32 25,25.31 24.58,25.31 24.57,25.32 U1.28
PWMB: length 13.4
  Top Layer w0.158: v1(26.82,16.41) 27.34,15.9 R49.1 ; U1.18 20.22,22.38 20.35,22.26 20.35,21.62 19.97,21.24 v1(19.97,20.86)
  Inner1 w0.158: v1(26.82,16.41) 23.9,16.41 19.97,20.35 v1(19.97,20.86)
PWMBH: length 5.1
  Top Layer w0.158: U10.23 27.6,29.25 25.17,26.82 U1.31
PWMBL: length 7.7
  Top Layer w0.158: U10.2 29.25,27.6 28.86,27.21 28.86,25.95 27.73,24.82 U1.27
PWMCH: length 5.2
  Top Layer w0.158: U10.24 27.73,28.75 25.31,26.32 25.01,26.32 25,26.33 24.58,26.33 24.57,26.32 U1.30
PWMCL: length 8.5
  Top Layer w0.158: U10.3 29.75,28.09 29.75,27.46 29.25,26.96 29.25,25.69 27.88,24.32 U1.26
REF: length 23.7
  Top Layer w0.254: U4.1 40.99,24.61 v1(41.3,24.92) ; U20.1 41.18,32.87 v1(41.18,33.3) ; U2.1 41.19,41.06 v1(41.3,41.18)
  Bottom Layer w0.254: v1(41.18,33.3) 40.43,34.05 40.29,34.05 ; v1(41.3,24.92) 41.3,25.65 40.3,26.65 40.29,26.65 40.29,34.05 ; 40.29,34.05 40.29,36.22 ; 40.29,36.22 39.27,37.24 R101.2 R102.1 ; 40.29,36.22 40.29,39.02 40.34,39.07 40.34,40.21 v1(41.3,41.18)
SH_A: length 54.2
  Top Layer w0.254: C123.1 29.16,23.38 v1(29.16,24.16) ; v1(26.95,32.54) 28.12,32.54 U10.18
  Inner1 w0.254: v1(52.35,37.09) 52.61,37.34 52.61,41.18 51.46,42.32 45.62,42.32 43.46,40.16 40.47,40.16 v2(39.78,39.47) 39.53,39.22 39.53,35.84 38.13,34.44 31.4,34.44 29.59,32.64 27.38,32.64 27.27,32.54 v1(26.95,32.54) 26.77,32.36 26.71,32.36 26.37,32.02 26.37,30.52 26.57,30.32 26.57,23.9 26.19,23.52 26.19,22.38 26.56,22.01 27.22,22.01 29.16,23.95 v1(29.16,24.16)
  vias: v1(52.35,36.48) v1(52.35,35.87) v1(52.96,37.09) v1(52.96,36.48) v1(52.96,35.87) v1(53.57,37.09) v1(53.57,36.48) v1(53.57,35.87) v1(54.18,37.09) v1(54.18,36.48) v1(54.18,35.87) v1(54.79,37.09) v1(54.79,36.48) v1(54.79,35.87) v1(55.4,37.09) v1(55.4,36.48) v1(55.4,35.87)
SH_B: length 42
  Top Layer w0.254: v1(35.08,30.89) 35.08,31.4 34.95,31.53 34.95,32.03 34.44,32.54 33.93,32.54 33.45,33.02 30.86,33.02 30.25,32.42 U10.15 ; v1(29.3,20.39) 29.3,21.11 C124.1
  Inner1 w0.254: v1(29.3,20.39) 29.3,22.06 33.18,25.94 33.18,28.98 33.73,29.54 33.73,29.81 34.08,30.15 34.34,30.15 v1(35.08,30.89) 35.97,30 35.97,28.86 36.15,28.68 39.7,28.68 42.32,26.06 50.34,26.06 v1(52.4,28.13)
  vias: v1(52.4,29.35) v1(52.4,28.74) v1(53.01,29.35) v1(53.01,28.74) v1(53.01,28.13) v1(53.62,29.35) v1(53.62,28.74) v1(53.62,28.13) v1(54.23,29.35) v1(54.23,28.74) v1(54.23,28.13) v1(54.84,29.35) v1(54.84,28.74) v1(54.84,28.13) v1(55.45,29.35) v1(55.45,28.74) v1(55.45,28.13)
SH_C: length 37.2
  Top Layer w0.254: C125.1 32.48,23.37 v1(33.14,24.02) ; U10.12 33.32,31.25 34.32,30.25 v1(34.32,29.56)
  Inner1 w0.254: v1(52.5,20.38) 49.55,17.43 42.83,17.43 34.95,25.3 34.95,28.93 v1(34.32,29.56)
  Bottom Layer w0.254: v1(34.32,29.56) 34.32,25.2 v1(33.14,24.02)
  vias: v1(52.5,21.6) v1(52.5,20.99) v1(53.11,21.6) v1(53.11,20.99) v1(53.11,20.38) v1(53.72,21.6) v1(53.72,20.99) v1(53.72,20.38) v1(54.33,21.6) v1(54.33,20.99) v1(54.33,20.38) v1(54.94,21.6) v1(54.94,20.99) v1(54.94,20.38) v1(55.55,21.6) v1(55.55,20.99) v1(55.55,20.38)
SL_A: length 12.4
  Top Layer w0.254: 50.15,41.05 48.86,39.76 U2.4
  Top Layer w0.381: 50.28,41.43 R96.2 ; 50.28,41.43 52.86,41.43 53.24,41.05 Q8.3 ; 50.28,41.43 50.45,41.6
SL_B: length 12
  Top Layer w0.254: R97.2 48.62,31.4 42.9,31.4 U20.4
  Top Layer w0.381: R97.2 50.78,33.56 52.86,33.56 53.24,33.17 Q10.3
SL_C: length 12.6
  Top Layer w0.254: R98.2 48.62,23.02 42.95,23.02
  Top Layer w0.381: R98.2 49.89,24.88 50.83,25.81 52.86,25.81 53.37,25.3 Q12.3
SPI1_CS: length 15.5
  Top Layer w0.158: v1(16.28,22.89) 16.28,23.1 U1.12
  Bottom Layer w0.158: v1(16.28,22.89) 16.92,23.52 19.46,23.52 20.22,24.28 26.19,24.28 28.09,26.19 U11.8
SPI1_MISO: length 16.1
  Top Layer w0.158: v1(18.19,21.87) 18.19,23.06 U1.14
  Bottom Layer w0.158: v1(18.19,21.87) 18.32,21.75 18.89,21.75 20.54,23.4 24.52,23.4 24.54,23.42 26.86,23.42 29.91,26.47 29.91,26.59 U11.6
SPI1_SCK: length 16.1
  Top Layer w0.158: U1.13 17.72,22.3 v1(17.3,21.87)
  Bottom Layer w0.158: U11.7 29.37,26.7 26.57,23.9 20.35,23.9 18.95,22.51 17.94,22.51 v1(17.3,21.87)
SPI3_CS: length 20.3
  Top Layer w0.158: U30.3 12.66,38.9 16.78,38.9 v3(19.61,36.07) ; U1.43 20.22,31.13 v3(20.21,31.14)
  Inner2 w0.158: v3(19.61,36.07) 19.61,34.52 19.23,34.14 19.23,32.07 19.59,31.71 19.59,31.4 19.84,31.14 v3(20.21,31.14)
SPI3_MISO: length 20.1
  Top Layer w0.158: U1.40 21.72,31.19 21.93,31.4 21.93,32.61 16.28,38.25 11.97,38.25 9.32,40.9 U30.5
SPI3_SCK: length 20.2
  Top Layer w0.158: U1.39 22.19,30.08 22.19,32.73 16.28,38.64 12.47,38.64 10.06,41.05 9.55,41.05 8.82,41.78 U30.4
SWCLK: length 26
  Top Layer w0.158: v1(23.88,31.78) 23.88,31.28 23.71,31.1 23.71,30.53 U1.37 ; 20.06,52.76 20.86,51.97 R86.2 21.76,51.1 v1(21.87,51.21)
  Inner1 w0.158: v1(21.87,51.21) 22,51.21 22.76,50.45 22.76,47.53 22,46.76 22,42.06 23.88,40.18 v1(23.88,31.78)
SWDIO: length 26
  Top Layer w0.158: U1.36 24.54,29.91 24.54,30.57 v2(24.22,30.89) ; U29.2 19.84,51.62 19.84,50.7 20.35,50.19 20.35,49.03 R85.1 20.73,48.17 v1(20.73,48.16)
  Inner1 w0.158: v1(20.73,48.16) 21.62,47.27 21.62,41.68 23.35,39.95 23.35,31.25 23.85,30.75 24.07,30.75 v2(24.22,30.89)
U1_RX: length 23
  Top Layer w0.158: U1.45 19.22,31.52 19.23,31.52 19.23,31.81 v3(20.09,32.67)
  Inner1 w0.158: v3(20.09,32.67) 20.63,33.2 20.63,46.74 17.94,49.43 17.93,49.43 v1(16.6,50.76)
U1_TX: length 23.4
  Top Layer w0.158: v3(20.05,31.94) 19.72,31.61 U1.44
  Inner1 w0.158: v1(15.73,50.26) 15.77,50.23 16.76,50.23 20.22,46.76 20.22,33.56 19.59,32.92 19.59,32.16 19.81,31.94 v3(20.05,31.94)
U2_RX: length 18.6
  Top Layer w0.158: v3(19.71,33.94) 20.72,32.92 U1.42
  Inner1 w0.158: v1(5.57,33.64) 19.42,33.64 v3(19.71,33.94)
U2_TX: length 21.4
  Top Layer w0.158: U1.41 21.26,30.08 v3(21.26,32.54)
  Inner1 w0.158: v3(21.26,32.54) 21.26,31.04 20.73,30.51 20.09,30.51 19.46,31.14 19.46,31.78 18.57,32.66 v1(5.36,32.66)
VB_A: length 13.8
  Top Layer w0.254: U10.20 28.08,30.76 v1(26.95,30.76) ; D3.4 29.77,21.89 29.56,22.09 28.82,22.09 C123.2 27.09,22.71 v1(26.93,22.71)
  Inner1 w0.254: v1(26.95,30.76) 26.95,22.74 v1(26.93,22.71)
VB_B: length 23.4
  Top Layer w0.254: C124.2 27.65,21.3 ; 27.65,21.3 v1(26.95,20.6) ; 27.65,21.3 27.65,20.79 28.63,19.81 29.63,19.81 29.89,20.06 29.89,21 30.13,21.24 D3.5 ; v1(26.95,33.3) 28.49,33.3 29.25,32.54 U10.17
  Inner1 w0.254: v1(26.95,33.3) 26.95,33.17 26.9,33.12 26.71,33.12 25.94,32.35 25.94,30.38 26.19,30.13 26.19,24.41 25.83,24.06 25.83,22.23 26.95,21.11 v1(26.95,20.6)
VB_C: length 18.6
  Top Layer w0.254: U10.14 30.75,32.41 31,32.67 33.3,32.67 v1(34.19,31.78) ; v1(30.51,24.16) 30.51,23.82 C125.2 30.95,22.95 31.52,22.38 31.52,20.86 31.25,20.59 30.74,20.59
  Inner1 w0.254: v1(30.51,24.16) 32.7,26.35 32.7,30.92 32.92,31.14 33.56,31.14 v1(34.19,31.78)
VREFA: length 4.1
  Top Layer w0.254: 15.57,18.14 15.04,17.61 R48.2 13.36,16.7 C57.1
VREFB: length 7.6
  Top Layer w0.254: v2(24.79,12.6) 25.42,13.23 R50.2
  Inner1 w0.254: v2(24.79,12.6) 22.38,15.01 21.36,15.01 20.51,15.86 v1(20.51,16.36)
$1N11598: length 13.8
  Top Layer w0.254: Q12.4 51.82,24.55 v1(51.21,24.55)
  Inner1 w0.254: v1(42.51,18.7) 42.51,21.55 43.59,22.63 49.29,22.63 v1(51.21,24.55)
$1N11606: length 13.2
  Top Layer w0.254: v1(51.21,32.29) 51.68,32.29 Q10.4
  Inner1 w0.254: v1(42.69,26.95) 42.69,28.72 43.59,29.62 43.59,30.51 44.1,31.02 49.94,31.02 v1(51.21,32.29)
$1N11613: length 9.7
  Top Layer w0.254: Q11.4 49.47,22.63 43.84,22.63 43.46,22.25 43.46,20.86 R89.2
$1N11614: length 9.5
  Top Layer w0.254: 42.69,28.73 42.95,28.73 43.59,29.36 43.59,30.51 44.1,31.02 49.47,31.02 Q9.4
$1N11628: length 12.8
  Top Layer w0.254: Q8.4 v1(51.21,40.33)
  Inner1 w0.254: v1(51.21,40.33) 50.28,39.4 43.97,39.4 43.59,39.02 43.59,37.62 42.7,36.73 42.7,35.46
  vias: v1(42.69,35.33)
$1N11631: length 9.6
  Top Layer w0.254: v1(50.23,38.64) 49.47,39.4 43.97,39.4 43.59,39.02 43.59,37.76 R87.2
$1N16076: length 10
  Bottom Layer w0.381: U23.3 31.27,39.14 31.27,37.24 30.51,36.48 28.86,36.48 28.42,36.91 C13.1 28.01,36.92 R72.2 R73.2
$1N16077: length 1.9
  Bottom Layer w0.381: U23.1 32.16,42.69 C100.1
$1N16078: length 10.3
  Bottom Layer w0.381: U24.3 33.7,17.05 35.72,17.05 36.35,16.41 36.35,14.69 C103.1 35.33,13.56 R74.2 R75.2
$1N16101: length 1.3
  Bottom Layer w0.254: R33.1 C54.1
$1N16132: length 1.9
  Bottom Layer w0.381: 29.24,17.24 30.01,18.02 U24.1
$1N16186: length 1.4
  Top Layer w0.158: LED6.2 9.41,22 R79.2
$1N16211: length 1.4
  Top Layer w0.254: LED7.2 32.06,10.4 R103.2
$1N21374: length 3.8
  Top Layer w0.254: C58.1 26.82,12.51 R49.2 26.82,13.87 25.94,14.76 R50.1
$1N21388: length 7.8
  Bottom Layer w0.254: v1(16.06,11.99) 12.58,11.99 10.28,14.29 9.39,14.29 R66.1
$1N21393: length 3.7
  Bottom Layer w0.254: v1(20.86,9.93) 21.75,9.93 22.85,8.83 24.13,8.83
$1N21396: length 4
  Top Layer w0.254: R48.1 13.87,18.83 13.49,18.44 12.29,18.44 R47.2 11.96,17.46 11.32,16.81
$1N21588: length 1.4
  Top Layer w0.254: R104.2 LED8.2

## Copper pours and planes (outline as drawn; the poured copper is in the pictures)
+5V on Bottom Layer: 28.67,37.67 25.88,37.67 25.88,39.65 22.34,39.65 22.34,41.43 28.6,41.43 28.67,41.37
+12V on Top Layer: 32.03,22.13 33.18,22.13 33.18,20.35 32.03,20.35
+12V on Bottom Layer: 31.14,8.48 31.14,10.08 31.27,10.08 31.27,14.38 34.29,14.38 34.29,11.76 32.85,11.76 32.85,10.19 32.53,10.19 32.53,8.5 31.15,8.5
AGND on Bottom Layer: 34.8,40.65 36.87,40.65 37.51,40.02 37.51,38.16 37.47,38.13 34.8,38.13 34.8,40.65
GND on Top Layer: outline of 208 points within -12.73,-12.91 72.73,72.55
GND on Bottom Layer: -1.24,63.4 60.73,63.4 60.73,-6.07 -1.24,-6.07
GND on Inner1: -1.5,62.77 60.73,62.77 60.73,-6.96 -1.5,-6.96
GND on Inner2: -1.37,62.26 62.51,62.26 62.51,-6.45 -1.37,-6.45
PGND on Top Layer: 28.6,62.39 64.04,62.39 64.29,62.13 64.29,-5.18 61.17,-2.06 28.73,-2.06 28.73,4.22 32.75,8.24 34.53,8.24 40.16,13.87 40.16,15.75 40.95,16.54 41.3,16.54 41.94,17.17 41.94,38.51 39.78,39.34 38.4,40.03 37.03,41.41 32.9,41.41 32.9,47.04 28.6,47.04
PGND on Bottom Layer: 28.86,62.26 28.86,55.15 31.14,52.86 31.14,50.93 30.25,50.93 30.25,48.42 33.28,45.39 33.28,41.28 37.03,41.28 38.4,39.9 39.78,39.21 41.94,38.38 41.94,17.05 41.3,16.41 40.95,16.41 40.16,15.62 40.16,13.74 34.53,8.12 32.75,8.12 28.73,4.09 28.73,-2.18 61.17,-2.18 64.29,-5.31 64.29,62 64.04,62.26
PGND on Inner2: 28.98,67.47 66.07,67.47 66.07,-8.48 28.98,-8.48
VCC on Top Layer: 33.81,60.35 33.94,60.48 38.64,60.48 38.76,60.35 38.76,53.37 45.75,46.38 45.75,43.84 45.62,43.72 37.07,43.72 37.07,51.38 33.81,54.64
VCC on Bottom Layer: 29.11,37.11 29.11,39.6 28.86,39.6 28.86,41.3 30.27,41.3 30.27,38.85 30.74,38.85 30.74,36.98 29.24,36.98
VCC on Bottom Layer: 31.4,14.76 35.72,14.76 35.72,16.45 31.4,16.45
VCC on Bottom Layer: 33.94,61.62 33.94,54.64 35.33,53.24 35.46,53.24 35.46,45.73 40.15,41.05 40.16,41.05 42.95,43.84 44.63,42.69 47.87,42.32 47.87,40.12 46.64,38.89 46.38,38.89 46.38,17.67 47.77,16.28 47.78,16.28 48.41,15.65 48.41,13.24 46.51,11.33 44.22,11.33 43.04,12.51 37.29,6.76 34.83,6.76 34.83,6.67 33.81,5.66 33.81,-0.48 34.06,-0.73 38.64,-0.73 39.14,-0.23 39.14,5.62 42.95,9.43 47.4,9.43 50.07,12.09 50.07,16.67 48.7,18.03 48.7,37.85 49.68,38.82 49.68,41.57 47.65,49.3 39.02,46.38 37.87,47.53 37.87,53.42 38.53,54.07 38.53,61.14 38.64,61.24 38.25,61.62
VCC on Inner1: 33.93,0.11 33.93,6.15 34.6,6.83 34.6,13.92 33.89,14.63 31.92,14.63 31.66,14.89 31.66,16.33 32.25,16.92 35.33,16.92 35.64,16.61 35.64,7 37.87,4.77 37.87,0.11
VCC on Inner1: 34.06,60.23 34.06,55.13 35.33,53.86 35.33,46.09 30.62,41.38 28.93,41.38 28.86,41.3 28.86,39.21 29.56,38.51 30.38,38.51 31.14,39.27 31.14,40.54 37.62,47.02 37.62,55.9 38.13,56.41 38.13,60.18 38.08,60.23
VCC on Inner2: 33.81,-1.37 33.81,6.69 37.49,6.69 37.49,6.7 43.09,12.29 44.05,11.33 46.51,11.33 48.41,13.24 48.41,15.65 46.64,17.43 44.6,17.43 44.6,39.02 46.71,39.02 46.71,43.43 46.3,43.84 43.08,43.84 42.48,43.25 40.06,44.71 36.35,45.88 35.46,45.88 35.46,53.13 33.81,54.78 33.81,60.19 38.83,60.19 38.83,54.32 49.56,43.59 49.56,38.95 48.8,38.19 48.8,17.94 50.07,16.67 50.07,11.97 47.4,9.3 42.76,9.3 39.14,5.68 39.14,-1.12 38.89,-1.37
A+ on Top Layer: 14.26,12.56 14.79,13.92 15.17,14.28 15.62,14.28 15.9,14 15.4,12.37 15.4,10.65 14.67,9.56 13.36,9.55 13.11,10.28 13.11,11.04
A- on Top Layer: 16.83,11.87 17.32,13.19 17.57,13.44 17.85,13.45 18.19,13.24 18.3,13.19 18.06,12.22 17.85,11.51 17.58,9.4 17.34,8.71 15.48,8.81 15.48,10.3 15.9,10.95
B+ on Top Layer: 19.84,12.31 20.06,12.57 20.4,12.57 20.9,12.31 20.6,11.33 20.35,10.7 20.09,9.3 19.88,8.5 19.29,7.9 18.57,7.9 17.8,8.15 17.76,8.29 17.7,8.71 17.81,9.3 17.89,9.5 19.46,11.08
B- on Top Layer: 21.75,10.06 22.13,11.2 22.46,11.68 23.26,11.53 23.09,10.63 22.33,8.52 22.33,7.5 21.75,6.92 20.39,7.09 20.11,7.37 20.09,7.72 20.21,8.79
SH_A on Top Layer: 49.65,37.73 51.59,37.73 51.59,38.89 56.2,38.89 56.2,36.06 57.93,36.06 60.35,33.63 60.35,30.89 56.92,30.89 56.92,34.06 51.54,34.06 51.54,34.57 49.64,34.57 49.65,34.58
SH_B on Top Layer: 49.69,29.33 51.59,29.33 51.59,31.16 56.16,31.16 56.16,30.76 60.35,30.76 60.35,27.33 56.16,27.33 56.16,26.37 50.83,26.37 50.83,26.15 49.69,26.15
SH_C on Top Layer: 49.69,17.81 50.83,17.81 50.83,18.55 56.33,18.55 56.33,20.52 59.59,23.78 60.42,23.78 60.42,27.21 56.92,27.21 56.92,24.28 56.03,23.4 51.72,23.4 51.72,20.98 49.67,20.98 49.67,17.82
SL_A on Top Layer: 52.86,40.92 56.25,40.92 56.25,39.65 52.86,39.65
SL_B on Top Layer: 56.54,33.3 56.54,32 52.86,32 52.86,33.3
SL_C on Top Layer: 52.99,25.56 56.54,25.56 56.54,24.35 56.48,24.28 52.99,24.28
$1N16072 on Bottom Layer: 30.34,43.96 30.34,42.95 30.02,42.95 30.02,41.59 28.87,41.59 28.87,42.17 24.16,42.17 24.16,43.97 30.33,43.97
$1N16082 on Bottom Layer: 28.73,10.4 30.38,10.4 30.38,14.63 30.51,14.76 31.16,14.76 31.16,15.9 29.73,15.9 29.73,16.27 28.74,16.27 28.73,16.28

Small or netless copper shapes (teardrops, artwork), in the pictures only: 3 on Top Layer

## Text on the board
Bottom Silkscreen Layer: ▲ | |+5V| | MT6701 | PGND | VCC | |+12V| | |+A3.3V|
Top Silkscreen Layer: ▲ | |+3.3V| | CANL | CANH | PGND | LED2 | LED1 | VCC | TX1 | RX1 | 3.3V | GND | SWD | SCK | MISO | CS | +3V3 | A+ | A- | B+ | B- | TX2 | RX2 | I2C1_SDA | I2C1_SCL | MCU> | Driver> | FOC_FD6288Q / TB67H450FNG | Motor GIM8108/ / 42步进电机 | STM32G431CBU6 | FD6288Q | Version:V4.0-High Current | Distance:44 | M2.5×2 | KEY2 | KEY1 | |RST| | A | B | C | SPI3
